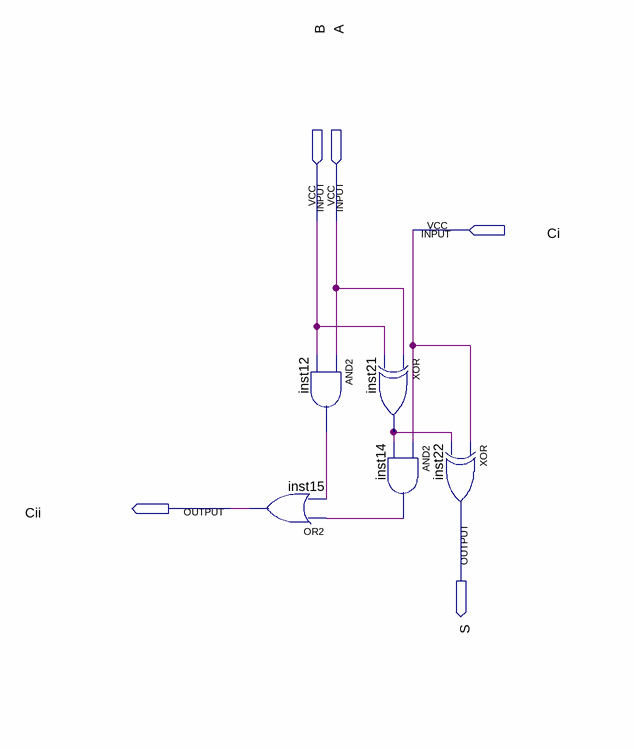
[diagram p0: schematic sheet]
// Quartus schematic FA.bdf as structural Verilog: 5 symbols, 5 pins
module FA (
  input  B,
  input  A,
  input  Ci,
  output Cii,
  output S
);

  wire inst12_out, inst14_out, inst21_out;

  and inst12 (inst12_out, A, B);
  or inst15 (Cii, inst14_out, inst12_out);
  xor inst21 (inst21_out, A, B);
  and inst14 (inst14_out, Ci, inst21_out);
  xor inst22 (S, Ci, inst21_out);
endmodule
